# Altium schematic sheet Temp_Sensor.SchDoc
size A4
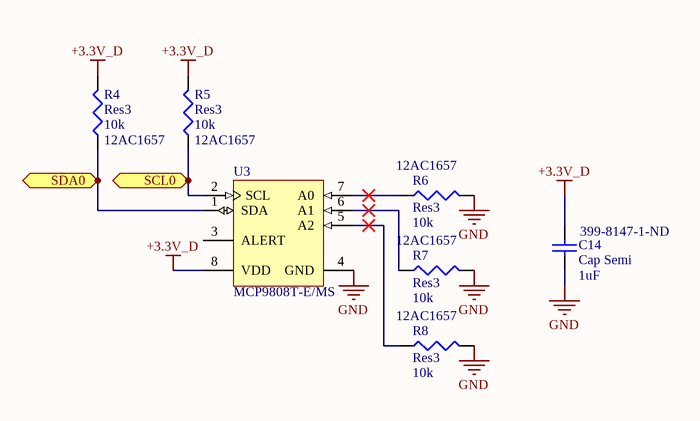
[diagram p0: Temp_Sensor.SchDoc]

## Parts
C14  Cap Semi  value 1uF  Supplier Part Number 1: 399-8147-1-ND  [C1206]
R4  Res3  value 10k  Supplier Part Number 1: 12AC1657  [6-0805_L]
R5  Res3  value 10k  Supplier Part Number 1: 12AC1657  [6-0805_L]
R6  Res3  value 10k  Supplier Part Number 1: 12AC1657  [6-0805_L]
R7  Res3  value 10k  Supplier Part Number 1: 12AC1657  [6-0805_L]
R8  Res3  value 10k  Supplier Part Number 1: 12AC1657  [6-0805_L]
U3  MCP9808T-E/MS  [MCHP-MSOP-MS8_M]

## Ports
SCL0 (bidir), SDA0 (bidir)

## Nets
+3.3V_D: C14.2 R4.2 R5.2 U3.8(VDD)
GND: C14.1 R6.2 R7.2 R8.2 U3.4(GND)
SCL0: R5.1 U3.2(SCL) ; port SCL0
SDA0: R4.1 U3.1(SDA) ; port SDA0
NetR6_1: R6.1 U3.7(A0)
NetR7_1: R7.1 U3.6(A1)
NetR8_1: R8.1 U3.5(A2)

Not connected (* = marked no-connect by the designer): U3 3(ALERT)

## Library data of the parts
C14 = Cap Semi: Multilayer Ceramic Capacitors MLCC - SMD/SMT 50volts 1uF X7R 10%; Manufacturer: KEMET; Manufacturer Part Number: C1206C105K5RACTU; SPN: 732-7692-1-ND; Voltage Rating (DC): 50V; Published: 8-Jun-2000; LatestRevisionDate: 29-May-2009; LatestRevisionNote: IPC-7351 Footprint Added.; PackageReference: C1206; Publisher: Altium Limited; PackageDescription: Chip Capacitor; Supplier 1: Digi-Key; RoHS: Yes; Category: Ceramic Capacitors; Stock 1: 155925; Pricing 1: 1=0.30000, 10=0.20900, 50=0.13940, 100=0.11850, 500=0.08364, 1000=0.07318 (USD); Mount: Surface Mount; Case/Package: 1206; Number of Pins: 2; Case Code (Imperial): 1206; Case Code (Metric): 3216; Dielectric Material: Ceramic; Min Operating Temperature: -55°C; Max Operating Temperature: 125°C; Capacitance: 1uF; Tolerance: 10%; Packaging: Tape and Reel; Dielectric: X7R; Voltage Rating: 50V; Termination: SMD/SMT; Package Quantity: 1; Voltage: 50V; Length: 3.2mm; Height: 1mm; Width: 0.063inch; Depth: 1.6mm; Thickness: 0.043inch; Radiation Hardening: No; REACH SVHC: No SVHC; ComponentLink1URL: https://datasheet.ciiva.com/7730/kem-c1002-x7r-smd-7730086.pdf?src-supplier=Element14; ComponentLink1Description: https://datasheet.ciiva.com/7730/kem-c1002-x7r-smd-7730086.pdf?src-supplier=Element14; ComponentLink2URL: https://datasheet.ciiva.com/6074/kem-c1002-x7r-smd-6074697.pdf?src-supplier=Farnell; ComponentLink2Description: https://datasheet.ciiva.com/6074/kem-c1002-x7r-smd-6074697.pdf?src-supplier=Farnell; ComponentLink3URL: https://datasheet.ciiva.com/22749/1918693-22749725.pdf?src-supplier=Element14; ComponentLink3Description: https://datasheet.ciiva.com/22749/1918693-22749725.pdf?src-supplier=Element14
R4-R8 = Res3: VISHAY BC COMPONENTS   MCT06030C1002FP500   RESISTOR, 0603, 10KOHM, 100mW, 1PER; SPN: RNCP0805FTD10K0CT-ND; Resistance: 10kR; Tolerance: 1%; Temperature Coefficient: 50ppm/°C; Voltage Rating: 75V; Max Power Dissipation: 125mW; Published: 8-Jun-2000; LatestRevisionDate: 29-May-2009; LatestRevisionNote: IPC-7351 Footprint Added.; PackageReference: J1-0603; Publisher: Altium Limited; PackageDescription: Chip Resistor; Supplier 1: Newark; Manufacturer: Vishay; Manufacturer Part Number: MCT06030C1002FP500; RoHS: Yes; Category: Chip SMD Resistors; Stock 1: 224988; Pricing 1: 1=0.02000, 5000=0.01900, 10000=0.01800, 20000=0.01700, 30000=0.01600 (USD); Mount: Surface Mount; Case/Package: 0603; Case Code (Imperial): 0603; Case Code (Metric): 1608; Contact Plating: Tin; Min Operating Temperature: -55°C; Max Operating Temperature: 125°C; Packaging: Tape and Reel; Composition: Thin Film; Power Rating: 100mW; Number of Terminations: 2; Military Standard: Not; Package Quantity: 1; Voltage Rating (DC): 75V; Length: 1.55mm; Height: 0.022inch; Width: 0.8mm; Depth: 0.85mm; Radiation Hardening: No; Lead Free: Lead Free; REACH SVHC: Unknown; ComponentLink1URL: https://datasheet.ciiva.com/7836/mc-pro-7836231.pdf?src-supplier=Element14; ComponentLink1Description: https://datasheet.ciiva.com/7836/mc-pro-7836231.pdf?src-supplier=Element14; ComponentLink2URL: https://datasheet.ciiva.com/2470/mc-pro-2470393.pdf?src-supplier=Digi-Key; ComponentLink2Description: https://datasheet.ciiva.com/2470/mc-pro-2470393.pdf?src-supplier=Digi-Key; ComponentLink3URL: https://datasheet.ciiva.com/48524/mc-pro-48524219.pdf?src-supplier=Avnet; ComponentLink3Description: https://datasheet.ciiva.com/48524/mc-pro-48524219.pdf?src-supplier=Avnet; ComponentLink4URL: https://datasheet.ciiva.com/16452/mc-pro-16452734.pdf?src-supplier=Future+Electronics; ComponentLink4Description: https://datasheet.ciiva.com/16452/mc-pro-16452734.pdf?src-supplier=Future+Electronics; ComponentLink5URL: https://datasheet.ciiva.com/22734/mc-pro-22734095.pdf?src-supplier=Element14; ComponentLink5Description: https://datasheet.ciiva.com/22734/mc-pro-22734095.pdf?src-supplier=Element14; ComponentLink6URL: https://datasheet.ciiva.com/2470/mc-pro-2470394.pdf?src-supplier=Digi-Key; ComponentLink6Description: https://datasheet.ciiva.com/2470/mc-pro-2470394.pdf?src-supplier=Digi-Key; ComponentLink7URL: https://datasheet.ciiva.com/2470/mc-pro-2470395.pdf?src-supplier=Digi-Key; ComponentLink7Description: https://datasheet.ciiva.com/2470/mc-pro-2470395.pdf?src-supplier=Digi-Key; ComponentLink8URL: https://datasheet.ciiva.com/5897/mc-pro-5897803.pdf?src-supplier=Farnell; ComponentLink8Description: https://datasheet.ciiva.com/5897/mc-pro-5897803.pdf?src-supplier=Farnell; ComponentLink9URL: https://datasheet.ciiva.com/16512/mc-pro-16512780.pdf?src-supplier=Avnet+Asia; ComponentLink9Description: https://datasheet.ciiva.com/16512/mc-pro-16512780.pdf?src-supplier=Avnet+Asia; ComponentLink10URL: https://datasheet.ciiva.com/16892/mc-pro-16892989.pdf?src-supplier=Avnet+Europe; ComponentLink10Description: https://datasheet.ciiva.com/16892/mc-pro-16892989.pdf?src-supplier=Avnet+Europe; ComponentLink11URL: https://datasheet.ciiva.com/9112/mc-pro-9112527.pdf?src-supplier=Avnet; ComponentLink11Description: https://datasheet.ciiva.com/9112/mc-pro-9112527.pdf?src-supplier=Avnet
U3 = CMP-0192-00343-1: + / - 0.5 degC Maximum Accuracy Digital Temperature Sensor, 400 uA, 2.7 to 5.5 V, -40 to 125 degC, 8-pin MSOP (MS8), Tape and Reel; Manufacturer: Microchip; PackageVersion: C04-111C; ComponentLink1URL: http://www.microchip.com; ComponentLink2URL: http://ww1.microchip.com/downloads/en/DeviceDoc/25095A.pdf; PackageReference: MSOP-MS8; ComponentLink2Description: Datasheet; DatasheetVersion: Rev. A; ComponentLink1Description: Manufacturer URL; PackageDescription: 8-Lead Plastic Micro Small Outline Package, 3 x 3 mm Body, 0.65 mm Pitch; ComponentLink3Description: Package Specification; ComponentLink3URL: http://www.microchip.com/stellent/groups/techpub_sg/documents/packagingspec/en012702.pdf; PartNumber: MCP9808T-E/MS; ComponentLink4URL: http://www.microchip.com/MCP9808; ComponentLink4Description: Product URL; Mounting Technology: Surface Mount